# EAGLE board isolator (EAGLE 5.06), part 1 of 2
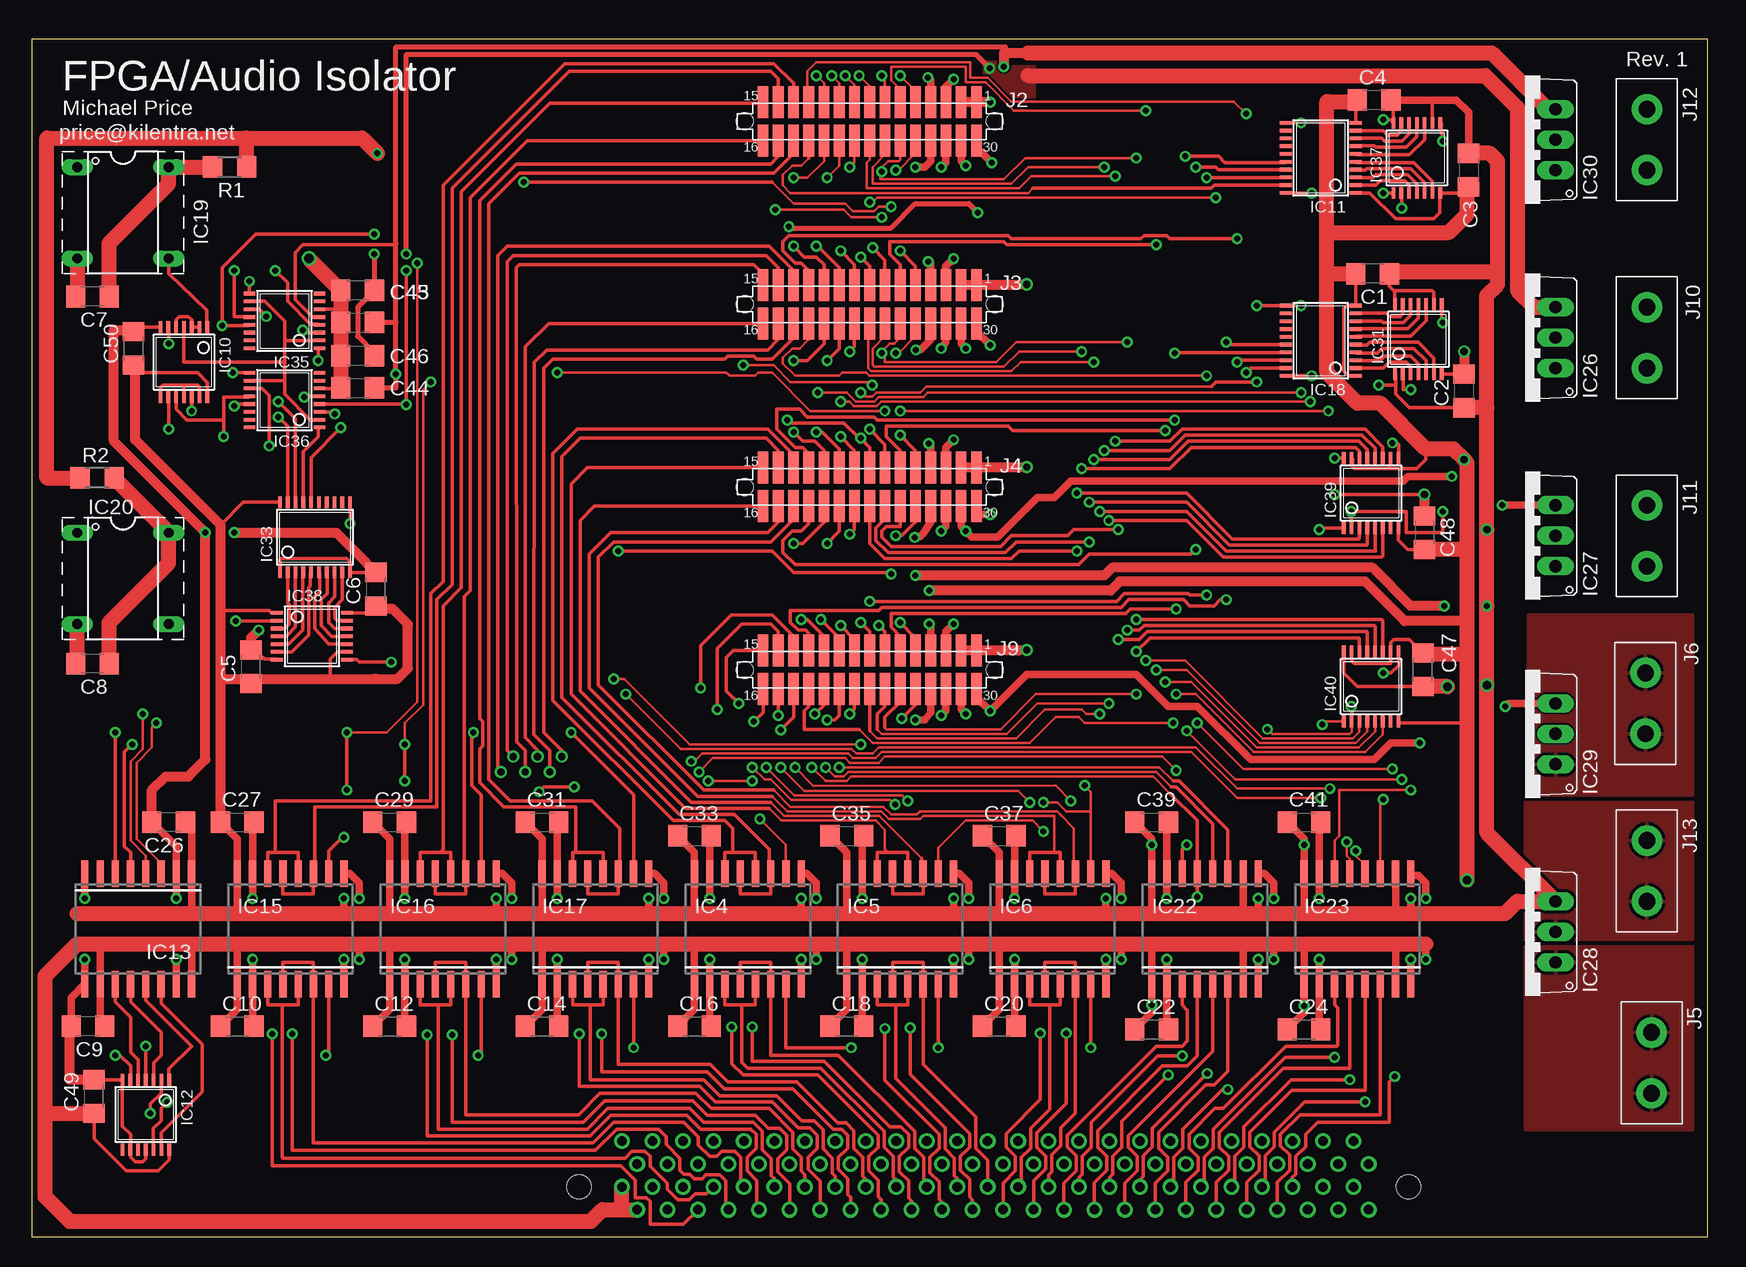
[diagram p9: board, top side]
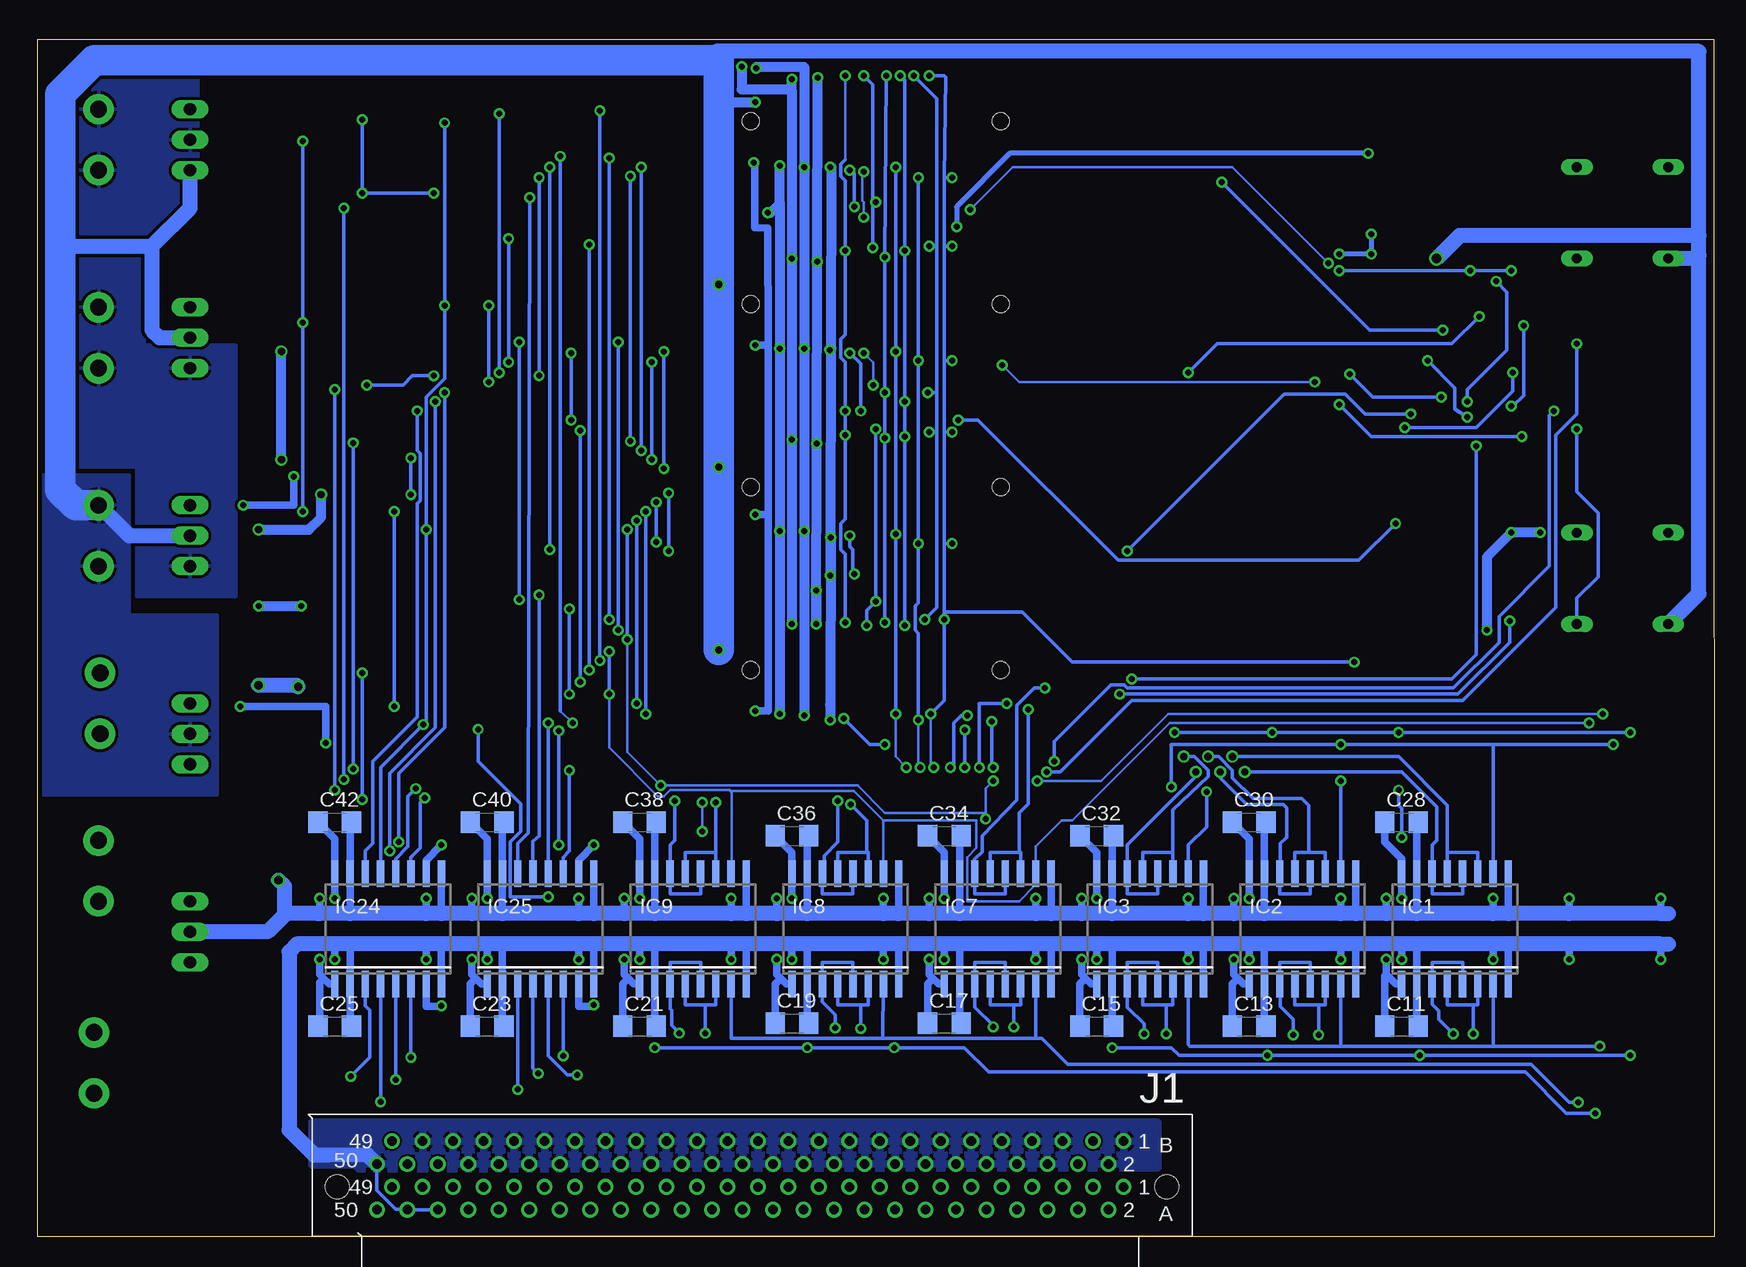
[diagram p10: board, bottom side, seen from below]

Size 139.7 x 99.83 mm. Coordinates in mm from the lower left corner, seen from the top.
Outline: 139.7,0 139.7,99.83 0.03,99.83 0,0 139.7,0
Copper layers (1*16): Top 0.035mm / dielectric 1.5mm / Bottom 0.035mm
Design rules "6mils": minimum track width 8mil, minimum drill 15mil, track to track 6mil, track to pad 6mil, pad to pad 6mil, via to via 6mil, smd to smd 6mil, copper to edge 15mil, drill to drill 8mil, minimum pad ring 10mil, minimum via ring 8mil, stop-mask expansion 4mil, vias tented up to drill 0mil, thermal gap 10mil

## Footprints (pad centres in the part's own frame; a part is rotated, then mirrored left to right if it is on the bottom)
C1206 = smd 1.6 x 1.8: 1 -1.4,0; 2 1.4,0
SO-16W = smd 0.6 x 2.2: 1 -4.445,-4.6; 2 -3.175,-4.6; 3 -1.905,-4.6; 4 -0.635,-4.6; 5 0.635,-4.6; 6 1.905,-4.6; 7 3.175,-4.6; 8 4.445,-4.6; 9 4.445,4.6; 10 3.175,4.6; 11 1.905,4.6; 12 0.635,4.6; 13 -0.635,4.6; 14 -1.905,4.6; 15 -3.175,4.6; 16 -4.445,4.6
TSSOP14 = smd 0.305 x 0.991: 1 -1.95,-2.918; 2 -1.3,-2.918; 3 -0.65,-2.918; 4 0,-2.918; 5 0.65,-2.918; 6 1.3,-2.918; 7 1.95,-2.918; 8 1.95,2.918; 9 1.3,2.918; 10 0.65,2.918; 11 0,2.918; 12 -0.65,2.918; 13 -1.3,2.918; 14 -1.95,2.918
TSSOP20 = smd 0.305 x 0.991: 1 -2.925,-2.918; 2 -2.275,-2.918; 3 -1.625,-2.918; 4 -0.975,-2.918; 5 -0.325,-2.918; 6 0.325,-2.918; 7 0.975,-2.918; 8 1.625,-2.918; 9 2.275,-2.918; 10 2.925,-2.918; 11 2.925,2.918; 12 2.275,2.918; 13 1.625,2.918; 14 0.975,2.918; 15 0.325,2.918; 16 -0.325,2.918; 17 -0.975,2.918; 18 -1.625,2.918; 19 -2.275,2.918; 20 -2.925,2.918
DIP4-XO = drill 0.813 long: 1 -3.81,-3.81; 4 3.81,-3.81; 5 3.81,3.81; 8 -3.81,3.81
TO220-PREG = drill 1.016 long: 1 -2.54,0; 2 0,0; 3 2.54,0
TO220-NREG = drill 1.016 long: 1 -2.54,0; 2 0,0; 3 2.54,0
TSSOP16 = smd 0.305 x 0.991: 1 -2.275,-2.918; 2 -1.625,-2.918; 3 -0.975,-2.918; 4 -0.325,-2.918; 5 0.325,-2.918; 6 0.975,-2.918; 7 1.625,-2.918; 8 2.275,-2.918; 9 2.275,2.918; 10 1.625,2.918; 11 0.975,2.918; 12 0.325,2.918; 13 -0.325,2.918; 14 -0.975,2.918; 15 -1.625,2.918; 16 -2.275,2.918
HIROSE-FX2-100 = drill 0.8 round: A1 -44.45,6.985; A2 -43.18,8.89; A3 -41.91,6.985; A4 -40.64,8.89; A5 -39.37,6.985; A6 -38.1,8.89; A7 -36.83,6.985; A8 -35.56,8.89; A9 -34.29,6.985; A10 -33.02,8.89; A11 -31.75,6.985; A12 -30.48,8.89; A13 -29.21,6.985; A14 -27.94,8.89; A15 -26.67,6.985; A16 -25.4,8.89; A17 -24.13,6.985; A18 -22.86,8.89; A19 -21.59,6.985; A20 -20.32,8.89; A21 -19.05,6.985; A22 -17.78,8.89; A23 -16.51,6.985; A24 -15.24,8.89; A25 -13.97,6.985; A26 -12.7,8.89; A27 -11.43,6.985; A28 -10.16,8.89; A29 -8.89,6.985; A30 -7.62,8.89; A31 -6.35,6.985; A32 -5.08,8.89; A33 -3.81,6.985; A34 -2.54,8.89; A35 -1.27,6.985; A36 0,8.89; A37 1.27,6.985; A38 2.54,8.89; A39 3.81,6.985; A40 5.08,8.89; A41 6.35,6.985; A42 7.62,8.89; A43 8.89,6.985; A44 10.16,8.89; A45 11.43,6.985; A46 12.7,8.89; A47 13.97,6.985; A48 15.24,8.89; A49 16.51,6.985; A50 17.78,8.89; B1 -44.45,3.175; B2 -43.18,5.08; B3 -41.91,3.175; B4 -40.64,5.08; B5 -39.37,3.175; B6 -38.1,5.08; B7 -36.83,3.175; B8 -35.56,5.08; B9 -34.29,3.175; B10 -33.02,5.08; B11 -31.75,3.175; B12 -30.48,5.08; B13 -29.21,3.175; B14 -27.94,5.08; B15 -26.67,3.175; B16 -25.4,5.08; B17 -24.13,3.175; B18 -22.86,5.08; B19 -21.59,3.175; B20 -20.32,5.08; B21 -19.05,3.175; B22 -17.78,5.08; B23 -16.51,3.175; B24 -15.24,5.08; B25 -13.97,3.175; B26 -12.7,5.08; B27 -11.43,3.175; B28 -10.16,5.08; B29 -8.89,3.175; B30 -7.62,5.08; B31 -6.35,3.175; B32 -5.08,5.08; B33 -3.81,3.175; B34 -2.54,5.08; B35 -1.27,3.175; B36 0,5.08; B37 1.27,3.175; B38 2.54,5.08; B39 3.81,3.175; B40 5.08,5.08; B41 6.35,3.175; B42 7.62,5.08; B43 8.89,3.175; B44 10.16,5.08; B45 11.43,3.175; B46 12.7,5.08; B47 13.97,3.175; B48 15.24,5.08; B49 16.51,3.175; B50 17.78,5.08 | hole 2: 21.09,6.984; -48.032,6.985
FCI-SMD-30 = smd 0.889 x 2.667: 1 -8.89,-1.6; 2 -7.62,-1.6; 3 -6.35,-1.6; 4 -5.08,-1.6; 5 -3.81,-1.6; 6 -2.54,-1.6; 7 -1.27,-1.6; 8 0,-1.6; 9 1.27,-1.6; 10 2.54,-1.6; 11 3.81,-1.6; 12 5.08,-1.6; 13 6.35,-1.6; 14 7.62,-1.6; 15 8.89,-1.6; 16 8.89,1.6; 17 7.62,1.6; 18 6.35,1.6; 19 5.08,1.6; 20 3.81,1.6; 21 2.54,1.6; 22 1.27,1.6; 23 0,1.6; 24 -1.27,1.6; 25 -2.54,1.6; 26 -3.81,1.6; 27 -5.08,1.6; 28 -6.35,1.6; 29 -7.62,1.6; 30 -8.89,1.6 | hole 1.4: -10.414,0; 10.414,0
FASTON-0.250 = drill 1.4 pad 2.54 round: A@1 -2.54,0; A@2 2.54,0
R1206 = smd 1.6 x 1.803: 1 -1.422,0; 2 1.422,0

## Placement (x,y rotation side)
C1  0.1u  [C1206]  111.76,80.26 180 top
C2  0.1u  [C1206]  119.38,70.48 90 top
C3  0.1u  [C1206]  119.76,88.9 270 top
C4  0.1u  [C1206]  111.89,94.74 180 top
C5  0.1u  [C1206]  18.29,47.5 90 top
C6  0.1u  [C1206]  28.7,53.98 90 top
C7  0.1u  [C1206]  5.08,78.36 180 top
C8  0.1u  [C1206]  5.08,47.75 180 top
C9  0.1u  [C1206]  4.7,17.53 180 top
C10  0.1u  [C1206]  17.15,17.53 0 top
C11  0.1u  [C1206]  26.04,17.53 0 bottom
C12  0.1u  [C1206]  29.85,17.53 0 top
C13  0.1u  [C1206]  38.74,17.53 0 bottom
C14  0.1u  [C1206]  42.55,17.53 0 top
C15  0.1u  [C1206]  51.44,17.53 0 bottom
C16  0.1u  [C1206]  55.25,17.53 0 top
C17  0.1u  [C1206]  64.14,17.78 0 bottom
C18  0.1u  [C1206]  67.95,17.53 0 top
C19  0.1u  [C1206]  76.84,17.78 0 bottom
C20  0.1u  [C1206]  80.65,17.53 0 top
C21  0.1u  [C1206]  89.54,17.53 0 bottom
C22  0.1u  [C1206]  93.35,17.27 0 top
C23  0.1u  [C1206]  102.24,17.53 0 bottom
C24  0.1u  [C1206]  106.05,17.27 0 top
C25  0.1u  [C1206]  114.94,17.53 0 bottom
C26  0.1u  [C1206]  11.43,34.54 180 top
C27  0.1u  [C1206]  17.15,34.54 0 top
C28  0.1u  [C1206]  26.04,34.54 0 bottom
C29  0.1u  [C1206]  29.85,34.54 0 top
C30  0.1u  [C1206]  38.74,34.54 0 bottom
C31  0.1u  [C1206]  42.55,34.54 0 top
C32  0.1u  [C1206]  51.44,33.4 0 bottom
C33  0.1u  [C1206]  55.25,33.4 0 top
C34  0.1u  [C1206]  64.14,33.4 0 bottom
C35  0.1u  [C1206]  67.95,33.4 0 top
C36  0.1u  [C1206]  76.84,33.4 0 bottom
C37  0.1u  [C1206]  80.65,33.4 0 top
C38  0.1u  [C1206]  89.54,34.54 0 bottom
C39  0.1u  [C1206]  93.35,34.54 0 top
C40  0.1u  [C1206]  102.24,34.54 0 bottom
C41  0.1u  [C1206]  106.05,34.54 0 top
C42  0.1u  [C1206]  114.94,34.54 0 bottom
C43  0.1u  [C1206]  27.18,78.87 180 top
C44  0.1u  [C1206]  27.18,73.41 180 top
C45  0.1u  [C1206]  27.18,76.2 0 top
C46  0.1u  [C1206]  27.18,70.74 0 top
C47  0.1u  [C1206]  115.95,47.24 90 top
C48  0.1u  [C1206]  116.08,58.67 270 top
C49  0.1u  [C1206]  5.21,11.68 90 top
C50  0.1u  [C1206]  8.51,74.04 90 top
IC1  ADUM3402  [SO-16W]  21.59,25.65 0 bottom
IC2  ADUM3402  [SO-16W]  34.29,25.65 0 bottom
IC3  ADUM3402  [SO-16W]  46.99,25.65 0 bottom
IC4  ADUM3402  [SO-16W]  59.69,25.65 0 top
IC5  ADUM3402  [SO-16W]  72.39,25.65 0 top
IC6  ADUM3402  [SO-16W]  85.09,25.65 0 top
IC7  ADUM3402  [SO-16W]  59.69,25.65 0 bottom
IC8  ADUM3402  [SO-16W]  72.39,25.65 0 bottom
IC9  ADUM3402  [SO-16W]  85.09,25.65 0 bottom
IC10  7404MT  [TSSOP14]  12.7,72.9 180 top
IC11  74LVTH574  [TSSOP20]  107.44,89.92 90 top
IC12  7404MT  [TSSOP14]  9.53,10.16 180 top
IC13  ADUM3400  [SO-16W]  8.89,25.65 180 top
IC15  ADUM3402  [SO-16W]  21.59,25.65 0 top
IC16  ADUM3402  [SO-16W]  34.29,25.65 0 top
IC17  ADUM3402  [SO-16W]  46.99,25.65 0 top
IC18  74LVTH574  [TSSOP20]  107.44,74.68 90 top
IC19  TENT-XO  [DIP4-XO]  7.62,85.34 270 top
IC20  TENT-XO  [DIP4-XO]  7.62,54.86 270 top
IC22  ADUM3401  [SO-16W]  97.79,25.65 0 top
IC23  ADUM3402  [SO-16W]  110.49,25.65 0 top
IC24  ADUM3401  [SO-16W]  110.49,25.65 0 bottom
IC25  ADUM3402  [SO-16W]  97.79,25.65 0 bottom
IC26  15V  [TO220-PREG]  127,74.93 90 top
IC27  5V  [TO220-PREG]  127,58.42 90 top
IC28  3.3V  [TO220-PREG]  127,25.4 90 top
IC29  3.3V  [TO220-PREG]  127,41.91 90 top
IC30  -15v  [TO220-NREG]  127,91.44 90 top
IC31  74164FT  [TSSOP14]  115.57,74.8 0 top
IC33  74LVTH574  [TSSOP20]  23.62,58.29 0 top
IC35  ADG1436YRUZ  [TSSOP16]  21.08,76.33 90 top
IC36  ADG1436YRUZ  [TSSOP16]  21.08,69.72 90 top
IC37  74164FT  [TSSOP14]  115.44,89.92 0 top
IC38  74164FT  [TSSOP14]  23.37,50.04 270 top
IC39  74165FT  [TSSOP16]  111.63,61.98 0 top
IC40  74165FT  [TSSOP16]  111.63,45.85 0 top
J1  HIROSE-FX2-100S-1.27DS  [HIROSE-FX2-100]  93.65,11.13 180 bottom
J2  SMD-30  [FCI-SMD-30]  69.85,92.96 180 top
J3  SMD-30  [FCI-SMD-30]  69.85,77.72 180 top
J4  SMD-30  [FCI-SMD-30]  69.85,62.48 180 top
J5  FASTON-0.250  [FASTON-0.250]  135,14.48 90 top
J6  FASTON-0.250  [FASTON-0.250]  134.49,44.45 270 top
J9  SMD-30  [FCI-SMD-30]  69.85,47.24 180 top
J10  FASTON-0.250  [FASTON-0.250]  134.62,74.93 90 top
J11  FASTON-0.250  [FASTON-0.250]  134.62,58.42 90 top
J12  FASTON-0.250  [FASTON-0.250]  134.62,91.44 90 top
J13  FASTON-0.250  [FASTON-0.250]  134.62,30.48 90 top
R1  Bead  [R1206]  16.51,89.15 180 top
R2  Bead  [R1206]  5.46,63.25 0 top

## Tracks (layer width: path | path; a pad name or v marks a point on that pad's centre or on a via)
!AMCS  (via drill 0.5)
  Top 0.229: v96.27,42.16 100.33,38.1 v114.17,38.1
  Top 0.305: IC22.14 95.89,32.26 v96.27,32.64 | v114.17,85.72 114.17,86.97 IC37.2
  Bottom 0.305: v96.27,32.64 v96.27,42.16 | v114.17,38.1 v114.17,85.72
!AMCS0
  Top 0.229: 64.77,89.92 64.14,89.28 63.37,89.28 62.61,88.52 62.61,87.63 63.25,87 83.06,87 83.45,87.39
  Top 0.305: 64.77,89.92 J2.19 | 83.45,87.39 98.3,87.38 98.55,87.64 IC11.19
!AMCS1  (via drill 0.5)
  Top 0.229: 64.77,74.8 64.01,74.04 63.37,74.04 62.61,73.28 62.61,72.77 63.63,71.75 67.31,71.75 67.56,72.01 69.55,72.01 69.8,71.75 v97.92,71.75
  Top 0.305: 64.77,74.8 J3.19 | IC11.18 98.2,88.29 v97.92,88.27
  Bottom 0.305: v97.92,71.75 v97.92,88.27
!AMCS2  (via drill 0.5)
  Top 0.305: J4.19 64.77,59.44 64.14,58.8 63.37,58.8 62.61,58.04 62.61,57.02 63.63,56.01 79.63,56.01 | 79.63,56.01 80.14,56.01 | IC11.17 98.89,88.94 98.68,89.15 v97.03,89.15 | v97.03,57.28 96.65,56.9 88.14,56.9 87.25,56.01 79.63,56.01
  Bottom 0.305: v97.03,57.28 v97.03,89.15
!AMCS3  (via drill 0.5)
  Top 0.229: v95.12,42.8 87.76,42.8 87.25,43.31 85.34,43.31 83.19,41.15 70.1,41.15 68.96,42.29
  Top 0.305: J9.19 64.77,44.2 64.39,43.81 64.39,42.29 68.96,42.29 | IC11.16 104.47,89.53 99.44,89.53 98.93,90.04 v96.14,90.04
  Bottom 0.229: v95.12,42.8 96.14,43.81
  Bottom 0.305: 96.14,43.81 v96.14,90.04
!DMCS  (via drill 0.5)
  Top 0.229: IC23.14 108.59,33.02 108.97,33.4 108.97,37.21 v114.94,37.21
  Top 0.305: v114.94,70.61 114.3,70.61 114.3,71.86 IC31.2
  Bottom 0.305: v114.94,37.21 v114.94,70.61
!DMCS0  (via drill 0.5)
  Top 0.229: J2.12 64.77,95.76 64.64,95.89 64.64,97.16 65.41,97.92 78.23,97.92 78.23,96.6 79.68,96.6 81.66,94.61 100.2,94.61 v101.22,93.6
  Top 0.305: IC18.19 101.61,72.4 v101.22,72.01
  Bottom 0.305: v101.22,93.6 v101.22,72.01
!DMCS1  (via drill 0.5)
  Top 0.305: J3.12 64.77,80.52 64.14,81.15 63.63,81.15 62.61,82.17 62.61,82.93 63.12,83.44 79.76,83.44 | 79.76,83.44 80.14,83.44 | IC18.18 100.61,73.05 v100.46,72.9 | 79.76,83.44 81.41,83.44 81.66,83.19 92.46,83.19 92.71,83.44 94.62,83.44 94.87,83.19 v100.46,83.19
  Bottom 0.305: v100.46,83.19 v100.46,72.9
!DMCS2  (via drill 0.5)
  Top 0.305: 64.77,64.01 J4.12 64.77,65.28 64.26,65.79 63.63,65.79 62.1,67.31 62.1,68.96 64.01,68.96 64.64,68.33 70.23,68.33 70.49,68.07 v95.25,68.07 | IC18.17 95.55,73.7 v95.25,73.66
  Bottom 0.305: v95.25,68.07 v95.25,73.66
!DMCS3  (via drill 0.5)
  Top 0.305: J9.12 64.77,50.29 64.52,50.55 63.88,50.55 63.25,51.18 63.25,52.2 70.61,52.2 70.87,52.45 90.81,52.45 91.44,53.09 96.01,53.09 96.52,52.58 98.55,52.58 99.06,53.09 v99.57,53.09 | IC18.16 99.75,74.35 v99.57,74.55
  Bottom 0.305: v99.57,53.09 v99.57,74.55
!ISLOTDIR0  (via drill 0.5)
  Top 0.305: v50.17,15.75 IC17.7 | IC16.7 37.47,15.37 v37.21,15.11 | IC15.7 24.77,15.37 v24.51,15.11 | v6.99,15.11 7.37,15.11 8.26,14.22 8.26,13.11 IC12.6
  Bottom 0.305: v50.17,15.75 45.21,15.75 44.58,15.11 v37.21,15.11 v24.51,15.11 v6.99,15.11
!ISLOTDIR1  (via drill 0.5)
  Top 0.305: IC12.4 v9.53,15.88
  Bottom 0.305: v9.53,15.88 18.54,15.88 | 18.54,15.88 30.99,15.88 | 30.99,15.88 43.69,15.88 43.82,16 IC3.7 | IC2.7 31.12,16 30.99,15.88 | IC1.7 18.42,16 18.54,15.88
!ISLOTDIR2  (via drill 0.5)
  Top 0.305: v88.27,15.75 IC6.7 | v75.57,15.75 IC5.7 | IC4.7 62.87,15.75 v68.33,15.75 | v9.91,10.29 9.91,11.05 10.8,11.94 10.8,13.05 IC12.2
  Bottom 0.305: v9.91,10.29 12.32,10.29 15.75,13.72 60.45,13.72 62.48,15.75 v68.33,15.75 v75.57,15.75 v88.27,15.75
!ISLOTDIR3  (via drill 0.5)
  Top 0.305: v11.3,11.18 10.8,10.67 10.8,9.65 10.16,9.02 10.16,7.26 IC12.12
  Bottom 0.305: v11.3,11.18 12.07,11.18 15.24,14.35 53.85,14.35 56.01,16.51 56.52,16.51 | 56.52,16.51 69.28,16.51 | 69.28,16.51 81.92,16.51 IC9.7 | 69.28,16.51 IC8.7 | 56.52,16.51 IC7.7
+15V  (via drill 0.5)
  Top 0.305: IC36.13 17.07,69.4 v16.89,69.22 | IC35.13 18.11,75.95 v15.88,75.95 15.88,80.77 18.67,83.57 v28.58,83.57
  Top 0.406: v28.58,81.92 v28.58,81.91 C43.1 27.18,77.47 27.18,75.06 28.58,73.66 C44.1 | v31.24,81.92 31.24,98.55 78.69,98.55 v79.83,97.41
  Top 0.61: J2.28 76.2,89.53 v75.82,89.15 | J3.28 76.2,74.55 v75.82,74.04 | J4.28 76.2,59.18 v75.82,58.8 | J9.28 76.2,43.81 v75.82,43.43
  Top 1.27: IC26.3 125.22,77.47 123.83,78.87 123.83,94.11 121.16,96.77 83.06,96.77
  Bottom 0.305: v16.89,69.22 16.76,69.22 15.88,70.1 v15.88,75.95
  Bottom 0.406: v31.24,81.92 v28.58,81.92 v28.58,83.57
  Bottom 0.813: v75.82,43.43 v75.82,58.8 v75.82,74.04 v75.82,89.15 75.82,97.51 79.78,97.51 v79.83,97.41
  pour Top: 79.38,97.92 81.28,97.92 81.28,97.54 83.57,97.54 83.57,95 81.03,95 79.38,96.65
-15V  (via drill 0.5)
  Top 0.305: IC35.5 23.42,76.65 21.97,78.11 21.97,82.04 22.61,82.68 30.23,82.68 30.35,82.8 | IC36.5 22.8,70.05 v22.73,69.98
  Top 0.406: 30.35,76.2 C45.2 | 30.35,76.2 30.35,82.8 30.35,99.19 81.15,99.19 81.15,98.81 81.03,98.68 | C46.2 30.35,70.74 30.35,71.63 v30.35,71.88 30.35,76.2
  Top 0.61: J2.3 76.2,95.86 v76.84,96.5 | J3.3 76.2,80.9 v76.84,81.53 | J4.3 76.2,65.79 v76.84,66.42 | J9.3 76.2,50.42 v76.84,51.05
  Top 0.813: 83.06,98.68 81.03,98.68 v81.03,97.54
  Top 1.27: IC30.3 126.37,93.98 121.67,98.68 83.06,98.68
  Bottom 0.305: v22.73,69.98 28.45,69.98 v30.35,71.88
  Bottom 0.813: v76.84,51.05 v76.84,66.42 v76.84,81.53 76.84,95.5 | 76.84,95.5 v76.84,96.5 | v81.03,97.54 81.03,95.63 76.96,95.63 76.84,95.5
A3.3V  (via drill 0.5)
  Top 0.61: J9.30 78.74,44.96 v79.88,43.81 82.93,46.86 92.08,46.86 94.74,44.2 97.16,44.2 101.6,39.75 111.89,39.75 113.28,41.15 v115.7,41.15 | J4.30 78.74,60.2 v79.88,60.2 | J3.30 78.74,75.44 v79.88,74.3 | J2.30 78.74,90.81 v80.01,89.53 | IC29.3 123.06,44.45 v122.81,44.2
  Bottom 0.61: 78.82,44.07 78.82,43.81 | 78.82,44.07 78.82,59.56 | 78.82,59.56 78.82,74.42 | 78.82,74.42 78.87,84.07 79.96,84.12 79.96,89.53 v80.01,89.53 | v79.88,43.81 79.12,43.81 78.82,44.07 | v79.88,60.2 78.87,60.2 78.82,59.56 | v79.88,74.3 78.99,74.3 78.82,74.42 | v122.81,44.2 115.7,44.2 v115.7,41.15
A5V  (via drill 0.5)
  Top 0.406: v78.87,85.34 78.11,86.11 73.66,86.11 71.63,84.07 63.25,84.07 v63.12,84.2
  Top 0.61: J2.29 77.47,89.66 v77.85,89.28 | J3.29 77.47,74.42 v77.85,74.04 | J4.29 77.47,59.18 v77.85,58.8 78.36,58.29 80.52,58.29 83.82,61.59 85.22,61.59 86.61,62.99 114.3,62.99 114.68,63.37 v118.36,63.37 | J9.29 77.47,43.94 v77.85,43.56 | v122.56,60.96 IC27.3
  Top 1.27: v28.83,90.3 27.56,91.57 17.91,91.57 | 17.91,91.57 1.27,91.57 1.27,63.25 3.81,63.25 3.84,63.22 R2.1 | R1.1 17.91,89.18 17.91,91.57
  Bottom 0.406: 63.12,84.07 v63.12,84.2 63.12,85.85 58.67,90.3 v28.83,90.3
  Bottom 0.61: v122.56,60.96 118.36,60.96 v118.36,63.37
  Bottom 0.813: v77.85,43.56 v77.85,58.8 v77.85,74.04 77.85,86.11 | 77.85,86.11 v77.85,89.28 | 77.85,86.11 78.61,85.34 v78.87,85.34
ACON0  (via drill 0.5)
  Top 0.229: J2.7 71.12,96.77 v70.87,96.77 | v98.68,86.61 70.49,86.61 70.1,86.23 v69.85,86.23
  Top 0.305: v70.1,82.42 71.12,81.41 J3.7
  Bottom 0.229: v69.85,86.23 70.1,86.23
  Bottom 0.305: v70.1,82.42 70.1,86.23 70.1,96.01 v70.87,96.77 | IC25.14 99.7,32.77 98.81,33.66 v98.68,86.61
ACON1  (via drill 0.5)
  Top 0.305: J4.7 71.12,66.04 v69.85,67.31 | v70.61,50.93 71.12,50.42 J9.7 | v69.85,52.96 90.42,52.96 91.06,53.59 96.39,53.59 96.52,53.47 v97.92,53.47
  Bottom 0.305: v70.61,50.93 70.61,52.2 v69.85,52.96 v69.85,67.31 | v97.92,53.47 97.92,33.4 98.43,32.92 IC25.13
AGND  (via drill 0.5, 0.6, 0.8)
  Top 0.305: IC35.6 25.44,77.3 25.78,76.96 | IC36.6 25.74,70.7 C46.1
  Top 0.813: J2.2 J2.1 v79.88,94.56 | J3.2 J3.1 82.09,79.32 v82.93,79.38 | J4.2 J4.1 82.25,64.08 v82.93,64.14 | J9.2 J9.1 82.25,48.84 v82.93,48.9
  Top 1.27: IC19.4 3.81,78.49 C7.2 | IC20.4 3.81,47.88 C8.2 | C46.1 C44.2 C45.1 25.78,76.96 C43.2 v23.11,81.53
  Bottom 0.305: 82.93,98.04 82.93,98.17 83.19,98.81
  Bottom 0.813: 82.93,94.56 v79.88,94.56
  Bottom 1.27: 83.19,98.81 1.27,98.81 1.27,83.44 | 1.27,81.79 1.27,53.59 IC20.4 | 1.27,81.79 1.27,83.44 | IC19.4 1.52,81.53 1.27,81.79 | v23.11,81.53 21.21,83.44 1.27,83.44 | IC30.1 127,85.72 130.18,82.55 | 130.18,82.55 137.16,82.55 137.8,84.45 | IC26.2 129.54,74.93 130.18,75.56 130.18,82.55 | IC27.2 132.08,58.42 J11.A@2
  Bottom 2.54: v82.93,48.9 v82.93,64.14 v82.93,79.38 82.93,94.56 82.93,98.04 135,98.04 137.8,95.25 137.8,84.45 137.8,62.23 136.53,60.96 J11.A@2
  pour Bottom (isolate 0.254): 132.08,63.5 139.7,63.5 139.7,36.83 132.08,36.83 124.71,36.83 124.71,51.82 132.08,51.82
AMDI  (via drill 0.5)
  Top 0.229: J2.21 67.31,89.28 v66.29,88.27 | 95,37.47 93.73,38.73 68.07,38.73 67.69,38.35 66.93,38.35 v66.17,39.12
  Top 0.305: J3.21 67.31,74.04 v66.29,73.03 | J4.21 67.31,58.8 v66.29,57.78 | J9.21 67.31,43.43 66.93,43.05 v66.29,43.05 | IC22.12 98.43,34.42 95.38,37.47 95,37.47
  Bottom 0.229: v66.17,39.12 66.29,39.24 v66.29,43.05
  Bottom 0.305: v66.29,88.27 v66.29,73.03 v66.29,57.78 66.29,52.83 66.55,52.58 66.55,50.55 66.29,50.29 v66.29,43.05
AMDO  (via drill 0.5)
  Top 0.229: v68.2,89.15 68.58,89.53 J2.22 | 95.12,37.97 93.98,39.12 v67.31,39.12
  Top 0.305: v68.2,73.79 68.58,74.17 J3.22 | v68.2,58.55 68.58,58.93 J4.22 | J9.22 68.58,43.94 v68.2,43.56 | IC22.11 99.7,33.91 95.63,37.97 95.12,37.97
  Bottom 0.229: v67.31,39.12 68.2,40.01 v68.2,43.56
  Bottom 0.305: v68.2,43.56 v68.2,58.55 v68.2,73.79 v68.2,89.15
AOVF  (via drill 0.5)
  Top 0.229: v97.16,42.8 100.97,38.99 v113.41,38.99
  Top 0.305: v113.41,66.17 113.79,66.17 113.92,66.04 113.92,64.91 IC39.9
  Bottom 0.305: IC25.12 v97.16,42.8 | v113.41,38.99 v113.41,66.17
AOVFL0  (via drill 0.5)
  Top 0.229: J2.23 69.85,89.79 69.6,89.53 69.6,87.38 82.3,87.38 83.31,88.39 v90.3,88.39
  Top 0.305: v90.3,66.29 94.87,66.29 95.89,67.31 111.13,67.31 112.61,65.83 IC39.11
  Bottom 0.305: v90.3,66.29 v90.3,88.39
AOVFL1  (via drill 0.5)
  Top 0.229: 69.72,74.93 69.72,72.39 69.98,72.14 81.66,72.14 82.42,72.9 v88.52,72.9
  Top 0.305: 69.72,74.93 69.85,74.93 J3.23 | v88.52,64.77 94.87,64.77 96.39,66.29 110.62,66.29 111.31,65.6 IC39.13
  Bottom 0.305: v88.52,72.9 v88.52,64.77
AOVFL2  (via drill 0.5)
  Top 0.305: J4.23 69.85,57.78 71.12,56.52 81.66,56.52 82.3,57.15 v87.12,57.15 | IC39.3 110.66,58.21 110.62,58.17 100.08,58.17 96.27,61.98 v87.12,61.98
  Bottom 0.305: v87.12,57.15 v87.12,61.98
AOVFL3  (via drill 0.5)
  Top 0.229: 69.85,42.16 70.49,41.53 82.04,41.53 84.46,43.94 87.5,43.94 87.88,43.56 v89.03,43.56
  Top 0.305: 69.85,42.16 J9.23 | IC39.5 111.96,57.21 112.01,57.15 99.57,57.15 96.27,60.45 v89.03,60.45
  Bottom 0.305: v89.03,43.56 v89.03,60.45
AOVFR0  (via drill 0.5)
  Top 0.229: 71.12,90.17 70.1,89.15 70.1,87.76 81.66,87.76 83.06,89.15 v89.41,89.15
  Top 0.305: 71.12,90.17 J2.24 | v89.41,65.53 94.87,65.53 96.14,66.8 110.87,66.8 111.96,65.72 IC39.12
  Bottom 0.305: v89.41,65.53 v89.41,89.15
AOVFR1  (via drill 0.5)
  Top 0.229: 71.12,75.06 70.1,74.04 70.1,72.64 70.23,72.52 81.03,72.52 82.3,73.79 v87.5,73.79
  Top 0.305: 71.12,75.06 J3.24 | v87.5,64.01 94.87,64.01 96.65,65.79 110.36,65.79 110.66,65.49 IC39.14
  Bottom 0.305: v87.5,73.79 v87.5,64.01
AOVFR2  (via drill 0.5)
  Top 0.305: J4.24 71.12,59.82 70.36,59.05 70.36,58.04 71.37,57.02 81.15,57.02 82.04,57.91 v88.14,57.91 | IC39.4 111.31,57.71 111.25,57.66 99.82,57.66 96.27,61.21 v88.14,61.21
  Bottom 0.305: v88.14,57.91 v88.14,61.21
AOVFR3  (via drill 0.5)
  Top 0.229: 70.49,42.29 70.87,41.91 81.28,41.91 83.82,44.45 v89.79,44.45
  Top 0.305: J9.24 71.12,44.2 70.49,43.56 70.49,42.29 | IC39.6 112.61,56.73 112.52,56.64 99.31,56.64 96.27,59.69 v89.79,59.69
  Bottom 0.305: v89.79,44.45 v89.79,59.69
CHAN0  (via drill 0.5)
  Top 0.229: J2.6 72.39,95.63 71.63,96.39 71.63,97.54 77.85,97.54 77.85,96.22 79.5,96.22 81.86,93.85 v92.84,93.85 | IC40.3 110.66,42.08 110.11,41.53 102.62,41.53 96.14,48.01 v92.84,48.01
  Bottom 0.305: v92.84,48.01 v92.84,93.85
CHAN1  (via drill 0.5)
  Top 0.229: IC40.4 111.31,42.09 110.36,41.15 102.36,41.15 96.27,47.24 v93.73,47.24
  Top 0.305: J3.6 72.39,81.03 71.5,81.92 71.5,82.93 81.03,82.93 81.28,82.68 v93.73,82.68
  Bottom 0.305: v93.73,47.24 v93.73,82.68
CHAN2  (via drill 0.5)
  Top 0.229: IC40.5 111.96,42.11 110.62,40.77 102.11,40.77 96.65,46.23 v94.49,46.23
  Top 0.305: J4.6 72.39,65.53 71.25,66.67 71.25,67.56 81.41,67.56 81.79,67.18 v94.49,67.18
  Bottom 0.305: v94.49,67.18 v94.49,46.23
CHAN3  (via drill 0.5)
  Top 0.229: IC40.6 112.61,41.87 111.13,40.39 101.85,40.39 97.03,45.21 v95.38,45.21
  Top 0.305: J9.6 72.39,50.04 71.63,50.8 71.63,51.94 91.19,51.94 91.57,52.32 v95.38,52.32
  Bottom 0.305: v95.38,52.32 v95.38,45.21
CLK0
  Top 0.305: IC19.5 11.43,80.26 14.61,77.22 14.61,75.86 IC10.1
CLK0A
  Top 0.305: IC10.4 12.7,72.9 21.08,72.9 | 21.08,72.9 21.08,71.37 | 21.08,71.37 21.08,70.23 23.24,68.07 23.97,68.07 IC36.2 | IC36.10 21.06,71.35 21.08,71.37 | 21.08,72.9 21.08,74.8 | 21.08,74.8 21.08,76.33 19.43,77.98 18.14,77.98 IC35.10 | IC35.2 21.18,74.7 21.08,74.8
CLK0B  (via drill 0.5)
  Top 0.229: v95.38,38.86 94.23,40.01 71.12,40.01 70.61,39.5 68.2,39.5 67.82,39.88 56.77,39.88 v55.63,38.73
  Top 0.305: v11.43,74.42 11.43,75.79 IC10.6
  Bottom 0.305: IC25.11 95.89,31.62 95.38,32.13 v95.38,38.86 | v55.63,38.73 54.48,38.73 48.51,44.7 20.96,44.7 13.21,52.45 13.21,66.8 11.43,68.58 v11.43,74.42
CLK1  (via drill 0.5)
  Top 0.305: IC10.9 11.43,69.95 v11.43,67.31
  Bottom 0.305: IC20.5 11.43,53.21 9.65,54.99 9.65,60.33 11.43,62.1 v11.43,67.31
CLK1A  (via drill 0.5)
  Top 0.305: v31.24,80.52 v31.24,69.34 31.19,69.4 IC36.4 | v16.89,80.52 16.89,76.71 18.11,76.71 IC35.12 | 16,68.07 v16,66.67 | IC36.12 18.09,69.98 16,69.98 16,68.07 | IC10.10 12.05,68.98 12.95,68.07 16,68.07 | IC35.4 23.95,76 23.88,76.07 23.24,76.07 21.34,77.98 21.34,79.5 v20.32,80.52
  Bottom 0.305: v16,66.67 28.58,66.67 v31.24,69.34 | v31.24,80.52 v20.32,80.52 v16.89,80.52
CLK1B  (via drill 0.5)
  Top 0.229: v107.44,36.58 100.46,36.58 96.65,40.39 70.87,40.39 70.36,39.88 68.45,39.88 68.07,40.26 55.88,40.26 55.25,39.62 v54.99,39.62
  Top 0.305: v13.34,68.83 13.34,69.97 IC10.12
  Bottom 0.305: IC24.11 108.59,31.62 107.82,32.38 107.82,36.2 v107.44,36.58 | v54.99,39.62 54.99,41.27 50.29,45.97 49.15,45.97 48.9,45.72 21.72,45.72 17.91,49.53 17.91,51.69 13.72,55.88 13.72,68.45 v13.34,68.83
CLKSEL  (via drill 0.5)
  Top 0.229: v108.2,37.34 100.46,37.34 97.03,40.77 70.61,40.77 70.1,40.26 68.71,40.26 68.33,40.64 54.1,40.64 v49.53,45.21
  Top 0.305: v17.02,51.31 20.42,51.31 IC38.2
  Bottom 0.305: IC24.12 109.86,31.5 108.84,32.51 108.84,36.7 v108.2,37.34 | v49.53,45.21 21.34,45.21 17.02,49.53 v17.02,51.31
CLKSEL0  (via drill 0.5)
  Top 0.305: IC33.19 21.35,67.55 v20.57,68.33 | v23.88,73.03 23.88,73.93 IC35.1
  Bottom 0.305: v20.57,68.33 21.59,68.96 21.59,70.74 v23.88,73.03
CLKSEL1  (via drill 0.5)
  Top 0.305: IC33.18 22,68.17 v20.57,69.6 | v18.16,79.63 IC35.9
  Bottom 0.305: v20.57,69.6 20.57,70.61 17.27,73.91 17.27,78.74 v18.16,79.63
CLKSEL2
  Top 0.305: IC33.17 22.65,65.45 23.88,66.67 23.88,67.32 IC36.1
CLKSEL3  (via drill 0.5)
  Top 0.305: IC33.16 23.3,64.95 v25.78,67.44 | v16.76,72.01 IC36.9
  Bottom 0.305: v25.78,67.44 19.81,67.44 16.76,70.48 v16.76,72.01
D3.3V  (via drill 0.5, 0.6, 0.7)
  Top 0.305: C4.1 113.49,94.54 IC37.14 113.24,93.09 v112.65,93.09 | IC37.9 116.74,94.71 116.71,94.74 | IC10.14 14.65,71.2 13.84,72.01 9.14,72.01 C50.1 | IC38.14 28.12,51.99 C6.1 | IC33.20 17.65,61.21 15.75,59.31 | IC38.1 20.02,51.99 19.81,52.2 15.75,52.2 | IC38.9 25.5,48.74 24.89,48.13 24.89,46.48 | C1.1 113.16,79.25 113.54,78.87 113.67,78.87 | 113.67,78.87 116.71,78.87 116.84,78.74 116.84,77.75 IC31.9 | IC31.14 113.62,78.82 113.67,78.87 | C2.1 114.81,69.09 113.67,70.23 113.67,70.99 | 113.67,70.99 113.67,71.84 IC31.1 | IC18.20 106.18,71.75 v106.68,71.75 | 113.67,70.99 v112.27,70.99 | IC39.16 108.84,64.89 v108.59,64.9 | v108.59,61.85 v116.08,61.85 C48.1 | IC11.20 v106.68,86.99 v106.68,87 | IC37.1 v112.65,87 | IC40.16 109.35,48.75 109.35,46.99 110.49,45.84 C47.1 | C27.1
  Top 0.61: 17.15,26.92 IC15.16 17.15,33.14 C27.1 | 29.85,26.92 IC16.16 29.85,33.14 C29.1 | 42.55,26.92 IC17.16 42.55,33.14 C31.1 | 55.25,26.92 IC4.16 55.25,32 C33.1 | 67.95,26.92 IC5.16 67.95,32 C35.1 | 80.65,26.92 IC6.16 80.65,32 C37.1 | C39.1 93.35,33.14 v93.35,32.64 IC22.16 93.35,26.92 | C41.1 106.05,33.14 v106.05,32.64 IC23.16 106.05,26.92 | C26.1 13.34,34.04 IC13.1 13.34,26.92 | 113.67,26.92 IC23.10 | 100.97,26.92 IC22.10 | 114.94,26.92 v114.94,28.19 | 102.24,26.92 v102.24,28.19 | 89.54,26.92 v89.54,28.19 | 76.84,26.92 v76.84,28.19 | 64.14,26.92 v64.14,28.19 | 51.44,26.92 v51.44,28.19 | 38.74,26.92 v38.74,28.19 | 26.04,26.92 v26.04,28.19 | v73.66,89.15 74.42,89.15 74.93,89.66 J2.27 | J3.27 74.93,74.76 74.12,73.92 v73.7,73.91 | J4.27 74.93,59.56 74.3,58.59 74.04,58.33 v73.62,58.29 | J9.27 74.93,43.69 74.42,43.05 v73.66,43.05 | C3.1 119.76,93.73 118.75,94.74 116.71,94.74 C4.1
  Top 0.813: C27.1 15.75,46.35 | 15.75,46.35 15.75,52.2 15.75,59.31 8.64,66.42 8.64,72.51 C50.1 | 28.83,52.32 30.1,52.32 31.37,51.05 31.37,47.37 30.48,46.48 28.7,46.48 | 28.83,52.32 28.7,52.32 | 28.7,46.48 28.58,46.48 | C6.1 28.7,52.45 28.83,52.32 | 18.42,46.48 15.88,46.48 15.75,46.35 | 18.42,46.48 24.89,46.48 28.7,46.48 | C5.1 18.29,46.35 18.42,46.48 | v116.08,61.85 116.08,60.2 | v73.66,55.12 89.41,55.12 90.04,55.75 111.76,55.75 114.94,52.58 v117.73,52.58
  Top 1.27: 3.81,26.92 13.34,26.92 17.15,26.92 26.04,26.92 29.85,26.92 38.74,26.92 42.55,26.92 51.44,26.92 55.25,26.92 64.14,26.92 67.95,26.92 76.84,26.92 80.65,26.92 89.54,26.92 93.35,26.92 100.97,26.92 102.24,26.92 106.05,26.92 113.67,26.92 114.94,26.92 122.81,26.92 123.83,27.94 IC28.3 121.29,33.66 v121.29,45.97 v121.29,52.58 v121.29,58.93 121.29,69.09 | 121.29,69.09 121.29,78.49 122.17,79.38 122.17,80.39 | 122.17,80.39 122.17,89.66 121.54,90.3 C3.1 | 122.17,80.39 113.16,80.39 C1.1 | 121.29,69.09 C2.1 | C47.1 v117.98,45.85
  Bottom 0.305: v73.7,73.91 73.7,74.17 73.57,74.3 | v106.68,71.75 108.46,71.75 109.22,70.99 v112.27,70.99 | v108.59,61.85 v108.59,64.9 | v112.65,93.09 v112.65,87 v106.68,87
  Bottom 0.61: C28.1 27.43,32.89 26.04,31.49 IC1.16 v26.04,28.19 | C30.1 38.74,33.14 IC2.16 v38.74,28.19 | C32.1 51.44,32 IC3.16 v51.44,28.19 | C34.1 64.14,32 IC7.16 v64.14,28.19 | C36.1 76.84,32 IC8.16 v76.84,28.19 | C38.1 89.54,33.14 IC9.16 v89.54,28.19 | C40.1 102.24,33.14 IC25.16 v102.24,28.19 | C42.1 114.94,33.14 IC24.16 v114.94,28.19 | IC25.10 94.62,31.37 v93.35,32.64 | IC24.10 107.32,31.37 v106.05,32.64 | 73.58,74.04 73.58,74.17 | v73.62,58.29 73.62,59.56 | v73.66,43.05 73.66,44.32
  Bottom 0.813: v73.66,43.05 73.66,44.32 v73.62,58.29 | v73.62,58.29 73.58,74.17 73.58,74.04 73.57,74.3 73.53,89.15 v73.66,89.15 | v116.08,61.85 116.08,59.94 117.09,58.93 v121.29,58.93 | v121.29,52.58 v117.73,52.58 | v73.66,55.12 73.62,55.16 v73.62,58.29
  Bottom 1.27: v117.98,45.85 118.11,45.97 v121.29,45.97
DGND  (via drill 0.5, 0.6, 0.7)
  Top 0.305: IC10.7 8.88,75.82 C50.2 8.51,75.56 | IC11.10 110.36,94.61 C4.2 | C3.2 119.26,87 IC37.7 117.35,86.95 117.35,85.34 116.84,84.84 113.67,84.84 111.51,86.99 IC11.1 | C6.2 IC33.10 | IC33.10 | IC33.1 20.7,56.38 20.83,56.52 26.29,56.52 26.54,56.26 IC33.10 | 20.7,58.67 | IC38.7 20.45,48.13 19.43,48.13 C5.2 | IC18.1 109.73,71.75 109.35,72.14 109.35,77.34 109.6,77.6 IC18.10 C1.2 | C1.2 | IC39.10 113.26,64.24 113.03,64.01 | 113.03,64.01 110.24,64.01 110.11,64.14 110.11,64.79 IC39.15 | IC31.7 117.48,71.84 | C2.2 IC31.7 | 113.03,64.01 115.44,64.01 116.21,64.77 116.21,65.66 | IC39.8 113.91,58.04 114.68,57.28 C48.2 | C47.2 114.81,49.78 113.54,49.78 113.26,49.5 IC40.10 113.28,48.74 113.28,47.75 110.24,47.75 110.01,47.98 IC40.15 | IC40.8 114.04,42.8 119.63,42.8 | IC31.7
  Top 0.61: v4.45,28.19 IC13.8 | C27.2 18.42,34.41 IC15.15 v18.42,28.19 | C29.2 31.12,34.41 IC16.15 v31.12,28.19 | C31.2 43.82,34.41 IC17.15 v43.82,28.19 | C33.2 56.52,33.27 IC4.15 v56.52,28.19 | C35.2 69.22,33.27 IC5.15 v69.22,28.19 | C37.2 81.92,33.27 IC6.15 v81.92,28.19 | C39.2 94.62,34.41 IC22.15 v94.62,28.19 | C41.2 107.32,34.41 IC23.15 v107.32,28.19 | C26.2 12.07,32.51 IC13.2 v12.07,28.19 | IC23.9 114.94,30.1 115.57,30.1 116.21,29.46 v116.21,28.19 | IC15.9 26.52,30.25 27.31,29.46 v27.31,28.19 | IC16.9 39.22,30.25 40.01,29.46 v40.01,28.19 | IC17.9 51.92,30.25 52.71,29.46 v52.71,28.19 | IC4.9 64.62,30.25 65.41,29.46 v65.41,28.19 | IC22.9 102.72,30.25 103.51,29.46 v103.51,28.19 | IC6.9 90.02,30.25 90.81,29.46 v90.81,28.19 | IC5.9 77.32,30.25 78.11,29.46 v78.11,28.19 | J2.4 74.93,96.39 v74.7,96.62 | J9.4 74.93,50.93 v74.8,51.05 | J3.4 74.93,81.07 v74.72,81.28 | J4.4 74.93,65.95 v74.76,66.12
  Top 0.813: 8.51,75.56 6.86,75.56 6.86,66.29 v14.48,58.67 14.48,39.75 13.08,38.35 11.18,38.35 10.03,37.21 C26.2 | v16.89,58.67 20.7,58.67 25.4,58.67 26.92,57.15 27.05,57.03 C6.2 | C5.2 18.29,49.91 v18.92,50.55 | v119.38,73.79 C2.2 | 119.63,51.31 114.43,51.31 111.13,54.61 90.68,54.61 89.92,53.85 v74.8,53.85
  Top 1.27: 107.95,80.39 107.95,83.69 | 107.95,83.69 107.95,94.61 | 107.95,94.61 110.36,94.61 | 107.95,94.61 | C1.2 108.08,80.26 107.95,80.39 | 107.95,83.69 118.11,83.69 119.63,85.22 119.63,87.5 C3.2 | v119.63,29.72 119.63,42.8 119.63,48.51 | 119.63,48.51 119.63,51.31 119.63,57.28 | 119.63,57.28 119.63,64.52 v119.38,64.77 118.49,65.66 116.21,65.66 112.4,69.47 110.49,69.47 107.95,72.01 107.95,80.39 | C48.2 116.2,57.28 119.63,57.28 | C47.2 116.08,48.51 119.63,48.51
  Bottom 0.61: 4.45,26.92 v4.45,28.19 | C28.2 24.77,34.41 IC1.15 24.77,26.92 | C30.2 37.47,34.41 IC2.15 37.47,26.92 | C32.2 50.17,33.27 IC3.15 50.17,26.92 | C34.2 62.87,33.27 IC7.15 62.87,26.92 | C36.2 75.57,33.27 IC8.15 75.57,26.92 | C38.2 88.27,34.41 IC9.15 88.27,26.92 | C42.2 113.67,34.41 IC24.15 113.67,26.92 | C40.2 100.97,34.41 IC25.15 100.97,26.92 | 27.31,26.92 v27.31,28.19 | 93.35,26.92 IC25.9 | 106.05,26.92 IC24.9 | 80.65,26.92 IC9.9 | 67.95,26.92 IC8.9 | 55.25,26.92 IC7.9 | 42.55,26.92 IC3.9 | 29.85,26.92 IC2.9 | 17.15,26.92 IC1.9 | 40.01,26.92 v40.01,28.19 | 52.71,26.92 v52.71,28.19 | 65.41,26.92 v65.41,28.19 | 78.11,26.92 v78.11,28.19 | 90.81,26.92 v90.81,28.19 | 103.51,26.92 v103.51,28.19 | 116.21,26.92 116.21,27.05 v116.21,28.19 | 18.42,26.92 v18.42,28.19 | 31.12,26.92 v31.12,28.19 | 43.82,26.92 v43.82,28.19 | 56.52,26.92 v56.52,28.19 | 69.22,26.92 v69.22,28.19 | 81.92,26.92 v81.92,28.19 | 94.62,26.92 v94.62,28.19 | 107.32,26.92 v107.32,28.19 | 12.07,26.92 v12.07,28.19 | v74.72,81.28 74.72,81.43
  Bottom 0.813: v74.7,96.62 74.72,81.43 v74.72,81.28 74.76,65.99 v74.76,66.12 v74.8,51.05 v74.8,53.85 | v14.48,58.67 v16.89,58.67 18.92,56.64 v18.92,50.55 | v119.38,73.79 119.38,64.9 119.32,64.83 v119.38,64.77
  Bottom 1.27: 3.81,26.92 4.45,26.92 12.07,26.92 17.15,26.92 18.42,26.92 24.77,26.92 27.31,26.92 29.85,26.92 31.12,26.92 37.47,26.92 40.01,26.92 42.55,26.92 43.82,26.92 50.17,26.92 52.71,26.92 55.25,26.92 56.52,26.92 62.87,26.92 65.41,26.92 67.95,26.92 69.22,26.92 75.57,26.92 78.11,26.92 80.65,26.92 81.92,26.92 88.27,26.92 90.81,26.92 93.35,26.92 94.62,26.92 100.97,26.92 103.51,26.92 106.05,26.92 107.32,26.92 113.67,26.92 116.21,26.92 | IC28.2 120.52,25.4 119.13,26.8 | 119.13,26.8 119,26.92 116.33,26.92 116.21,27.05 | v119.63,29.72 119.13,29.21 119.13,26.8
  pour Top (isolate 0.254): 138.43,24.77 138.43,36.2 124.46,36.2 124.46,24.77
DIR/CHAN  (via drill 0.5)
  Top 0.229: IC23.11 112.4,36.2 v112.65,36.45
  Top 0.305: v112.65,46.99 113.28,46.99 113.92,47.62 IC40.9
  Bottom 0.305: v112.65,36.45 v112.65,46.99
DMDI  (via drill 0.5)
  Top 0.229: v66.68,96.77 67.31,96.14 J2.10 | IC23.13 109.86,31.5 109.6,31.75 v109.6,32.89 | v65.53,70.36 67.95,70.36 68.68,69.62 70.23,69.62 70.59,69.98 74.3,69.98 74.68,70.36 v105.79,70.36
  Top 0.305: v65.41,82.55 65.53,82.55 67.31,80.77 J3.10 | v65.41,67.06 65.91,67.06 67.31,65.66 J4.10 | J9.10 67.31,49.91 v65.79,51.44
  Bottom 0.305: 64.77,67.06 64.77,52.45 v65.79,51.44 | 64.77,67.06 64.77,70.36 | 64.77,82.55 64.77,94.87 v66.68,96.77 | 64.77,82.55 v65.41,82.55 | 64.77,67.06 v65.41,67.06 | v109.6,32.89 109.6,38.61 105.79,42.42 v105.79,70.36 | 64.77,70.36 64.77,82.55 | 64.77,70.36 v65.53,70.36
DMDO  (via drill 0.5)
  Top 0.229: J2.9 68.58,96.01 v67.82,96.77 | 111.13,30.99 110.36,31.75 v110.36,32.13 | v67.44,69.6 68.15,69.6 68.5,69.24 70.43,69.24 70.79,69.6 v106.55,69.6
  Top 0.305: J3.9 68.58,81.03 v67.44,82.17 | J4.9 68.58,65.53 v67.44,66.67 | J9.9 68.58,49.78 v67.44,50.93 | 111.13,30.99 IC23.12
  Bottom 0.305: v67.82,96.77 67.44,96.39 v67.44,82.17 v67.44,69.6 v67.44,66.67 v67.44,50.93 | v110.36,32.13 110.36,38.61 106.55,42.42 v106.55,69.6
F0DATA0
  Top 0.305: IC15.3 19.69,19.3 20.89,19.3 | 20.89,19.3 22.23,19.3 IC15.5 | J1.A7 56.24,3.56 55.31,3.56 54.8,3.05 53.85,3.05 52.96,3.94 52.96,4.45 51.56,5.84 51.56,6.67 51.12,7.11 50.04,7.11 49.47,6.54 20.96,6.54 20.89,6.6 20.89,19.3
F0DATA1
  Top 0.305: IC15.4 20.96,22.86 23.5,22.86 IC15.6 23.5,7.81 46.8,7.81 48.51,9.53 54.36,9.53 55.56,8.32 55.56,7.62 56.52,6.67 57.09,6.67 57.53,7.11 58.61,7.11 59.12,6.6 59.12,4.38 J1.A9
F0DATA2
  Top 0.305: IC16.3 32.39,19.3 33.91,19.3 | 33.91,19.3 34.93,19.3 IC16.5 | J1.A11 61.9,4.84 61.66,5.08 61.66,6.48 60.9,7.24 60.9,8.76 60.14,9.53 56.01,9.53 54.86,10.67 48.01,10.67 46.29,8.95 33.91,8.95 33.91,19.3
F0DATA3
  Top 0.305: IC16.4 33.66,22.86 36.2,22.86 IC16.6 36.2,10.16 45.59,10.16 47.37,11.94 55.37,11.94 56.64,10.67 61.47,10.67 63.44,8.7 63.44,7.3 64.14,6.6 64.14,5.46 64.44,5.16 J1.A13
F0DATA4
  Top 0.305: IC17.3 45.09,19.3 46.67,19.3 | 46.67,19.3 47.63,19.3 IC17.5 | J1.A15 66.98,5.03 66.74,5.27 66.74,6.54 65.98,7.3 65.98,8.89 65.22,9.65 64.2,9.65 62.1,11.75 57.34,11.75 56.01,13.08 46.55,13.08 46.55,19.18 46.67,19.3
F0DATA5
  Top 0.305: IC17.4 46.36,22.86 48.9,22.86 IC17.6 48.9,14.35 56.58,14.35 58.04,12.89 63.75,12.89 67.18,9.46 67.88,9.46 68.52,8.83 68.52,7.37 69.28,6.6 69.28,5.02 69.52,4.78 J1.A17
F1DATA0  (via drill 0.5)
  Top 0.305: J1.A8 57.85,2.48 57.85,4.64 57.34,5.14 56.2,5.14 55.88,4.83 55.25,4.83 54.86,5.21 54.36,5.21 54.04,5.52 54.04,6.54 52.9,7.68 52.9,8.32 52.26,8.95 48.77,8.95 46.99,7.18 21.72,7.18 v21.72,16.89
  Bottom 0.305: IC1.5 20.96,22.86 23.5,22.86 IC1.3 23.5,19.37 22.92,18.8 22.92,18.1 v21.72,16.89
F1DATA1  (via drill 0.5)
  Top 0.305: J1.A6 54.33,1.02 51.56,1.02 51.56,2.92 51.25,3.24 50.29,3.24 50.29,4.7 49.09,5.91 20.07,5.91 v20.07,16.89
  Bottom 0.305: IC1.4 22.23,19.3 20.07,19.3 | 20.07,19.3 19.69,19.3 IC1.6 | v20.07,16.89 20.07,19.3
F1DATA2  (via drill 0.5)
  Top 0.305: J1.A12 63.17,4.39 62.17,5.4 62.17,6.48 62.93,7.24 62.93,8.45 62.36,9.02 61.4,9.02 60.33,10.1 56.33,10.1 55.12,11.3 47.75,11.3 45.97,9.53 35.05,9.53 v35.05,16.83
  Bottom 0.305: IC2.5 33.66,22.86 36.2,22.86 IC2.3 36.13,20.99 36.13,19.18 35.05,18.1 v35.05,16.83
F1DATA3  (via drill 0.5)
  Top 0.305: J1.A10 60.45,2.41 60.45,4.64 59.63,5.46 59.63,6.6 60.39,7.37 60.39,8.51 59.94,8.95 55.75,8.95 54.61,10.1 48.26,10.1 46.55,8.38 32.96,8.38 v32.96,16.83
  Bottom 0.305: IC2.4 34.93,19.3 32.96,19.3 | 32.96,19.3 32.39,19.3 IC2.6 | v32.96,16.83 32.96,19.3
F1DATA4  (via drill 0.5)
  Top 0.305: J1.A16 68.25,3.25 68.01,3.49 68.01,4.83 67.25,5.59 67.25,6.6 68.01,7.37 68.01,8.45 67.5,8.95 66.8,8.95 63.44,12.32 57.72,12.32 56.33,13.72 47.5,13.72 v47.5,16.89
  Bottom 0.305: IC3.5 46.36,22.86 48.9,22.86 IC3.3 48.9,19.11 47.5,17.72 v47.5,16.89
F1DATA5  (via drill 0.5)
  Top 0.305: J1.A14 65.71,4.58 64.71,5.59 64.71,6.6 65.47,7.37 65.47,8.45 64.83,9.08 63.88,9.08 61.72,11.24 56.96,11.24 55.69,12.51 45.66,12.51 v45.66,16.89
  Bottom 0.305: IC3.4 47.63,19.3 45.66,19.3 | 45.66,19.3 45.09,19.3 IC3.6 | v45.66,16.89 45.66,19.3
F2DATA0
  Top 0.305: IC4.3 57.79,19.3 59.31,19.3 | 59.31,19.3 60.33,19.3 IC4.5 | J1.A19 72.06,4.71 71.82,4.95 71.82,6.67 71.06,7.43 71.06,8.76 65.79,14.03 59.69,14.03 59.18,14.54 59.18,19.18 59.31,19.3
F2DATA1
  Top 0.305: IC4.4 59.06,22.86 61.6,22.86 IC4.6 61.6,15.11 67.25,15.11 73.6,8.76 73.6,7.37 74.36,6.6 74.36,4.83 74.6,4.58 J1.A21
F2DATA2
  Top 0.305: IC5.3 70.49,19.3 72.07,19.3 | 72.07,19.3 73.03,19.3 IC5.5 | J1.A23 77.14,4.84 76.9,5.08 76.9,6.54 76.14,7.3 76.14,9.08 72.01,13.21 72.01,19.24 72.07,19.3
F2DATA3
  Top 0.305: IC5.4 71.76,22.86 74.3,22.86 IC5.6 74.3,14.35 78.68,9.97 78.68,7.37 79.68,6.36 J1.A25
F2DATA4
  Top 0.305: IC6.5 85.73,19.3 84.84,19.3 | 84.84,19.3 83.19,19.3 IC6.3 | J1.A27 82.49,4.41 82.49,6.6 83.25,7.37 83.25,9.02 84.84,10.6 84.84,19.3
F2DATA5
  Top 0.305: IC6.4 84.46,22.86 87,22.86 IC6.6 87,10.29 85.79,9.08 85.79,7.56 85.03,6.79 85.03,5.4 84.77,5.14 J1.A29
F3DATA0  (via drill 0.5)
  Top 0.305: J1.A20 73.33,3 73.09,3.24 73.09,4.64 72.33,5.4 72.33,6.67 73.09,7.43 73.09,8.51 72.45,9.14 71.5,9.14 66.04,14.61 60.07,14.61 v60.07,17.46
  Bottom 0.305: IC7.5 59.06,22.86 61.6,22.86 IC7.3 61.66,20.99 61.66,20.38 61.6,20.32 61.6,19.11 60.07,17.59 v60.07,17.46
F3DATA1  (via drill 0.5)
  Top 0.305: J1.A18 70.79,3.06 70.55,3.3 70.55,4.7 69.79,5.46 69.79,6.67 70.55,7.43 70.55,8.45 65.53,13.46 59.31,13.46 58.36,14.41 v58.36,17.46
  Bottom 0.305: IC7.4 60.33,19.3 58.23,19.3 | 58.23,19.3 57.79,19.3 IC7.6 | v58.36,17.46 58.36,19.18 58.23,19.3
F3DATA2  (via drill 0.5)
  Top 0.305: J1.A24 78.41,3.06 78.17,3.3 78.17,4.76 77.41,5.52 77.41,6.67 78.17,7.43 78.17,8.57 73.22,13.53 v73.22,17.4
  Bottom 0.305: IC8.5 71.76,22.86 74.3,22.86 IC8.3 74.3,19.56 73.22,18.48 v73.22,17.4
F3DATA3  (via drill 0.5)
  Top 0.305: J1.A22 75.87,2.87 75.63,3.11 75.63,4.57 74.87,5.33 74.87,6.6 75.63,7.37 75.63,8.51 71.12,13.02 v71.12,17.34
  Bottom 0.305: IC8.4 73.03,19.3 71.06,19.3 | 71.06,19.3 70.49,19.3 IC8.6 | v71.12,17.34 71.12,19.24 71.06,19.3
F3DATA4  (via drill 0.5)
  Top 0.305: J1.A28 83.5,2.25 83.5,4.64 84.52,5.65 84.52,6.67 83.76,7.43 83.76,8.64 86.23,11.11 v86.23,16.95
  Bottom 0.305: IC9.5 84.46,22.86 87,22.86 IC9.3 87,18.99 86.87,18.86 86.87,17.59 v86.23,16.95
F3DATA5  (via drill 0.5)
  Top 0.305: J1.A26 80.96,2.25 80.96,4.45 81.98,5.46 81.98,6.67 81.22,7.43 81.22,8.57 84.07,11.43 v84.07,16.95
  Bottom 0.305: IC9.6 83.19,19.3 84.07,19.3 | 84.07,19.3 85.73,19.3 IC9.4 | v84.07,16.95 84.07,19.3
FACON0
  Top 0.305: J1.A44 103.82,2.25 103.82,4.51 104.84,5.52 104.84,6.79 104.08,7.56 104.08,8.51 105.73,10.16 112.4,10.16 IC23.6
FACON1  (via drill 0.5)
  Top 0.305: J1.A37 95.19,4.41 95.19,6.6 95.95,7.37 95.95,8.95 99.25,12.26 v99.7,12.26
  Bottom 0.305: v99.7,12.26 IC25.3
FACON2  (via drill 0.5)
  Top 0.305: J1.A35 92.38,4.75 92.65,5.02 92.65,6.73 93.41,7.49 93.41,9.02 v97.98,13.59
  Bottom 0.305: v97.98,13.59 98.43,14.03 IC25.4
FACON3  (via drill 0.5)
  Top 0.305: J1.A33 89.84,4.94 90.11,5.21 90.11,6.67 90.87,7.43 90.87,9.59 v94.74,13.46
  Bottom 0.305: v94.74,13.46 95.57,13.46 97.16,15.05 IC25.5
FASP0
  Top 0.305: J1.A30 86.03,4.43 87.06,5.46 87.06,6.73 86.3,7.49 86.3,8.45 93.73,15.88 95.89,15.88 96.33,16.32 96.33,18.86 95.89,19.3 IC22.3
FASP1
  Top 0.305: J1.A32 88.57,4.5 89.6,5.52 89.6,6.67 88.84,7.43 88.84,8.83 94.23,14.22 96.33,14.22 97.16,15.05 IC22.4
FASP2
  Top 0.305: J1.A34 91.11,4.43 92.14,5.46 92.14,6.67 91.38,7.43 91.38,8.38 98.43,15.43 IC22.5
FASP3
  Top 0.305: J1.A36 93.66,2.25 93.66,4.45 94.68,5.46 94.68,6.6 93.92,7.37 93.92,8.7 97.85,12.64 98.55,12.64 99.7,13.78 IC22.6
FDSP0
  Top 0.305: J1.A38 96.2,2.25 96.2,4.51 97.22,5.52 97.22,6.6 96.46,7.37 96.46,8.51 98.62,10.67 99.31,10.67 104.52,15.88 108.78,15.88 108.84,15.94 108.84,19.05 108.59,19.3 IC23.3
FDSP1
  Top 0.305: J1.A40 98.74,2.25 98.74,4.51 99.76,5.52 99.76,6.67 99,7.43 99,8.7 104.33,14.03 109.86,14.03 IC23.4
FDSP2
  Top 0.305: J1.A42 101.28,2.25 101.28,4.51 102.3,5.52 102.3,6.73 101.54,7.49 101.54,8.7 105.03,12.19 111.13,12.19 IC23.5
FPGA_3.3V  (via drill 0.5)
  Top 0.305: IC12.14 11.48,6.39 10.54,5.46 7.87,5.46 5.21,8.13 C49.1
  Top 0.61: 5.72,24.38 IC13.10 5.72,17.66 C9.1 | 17.15,24.38 IC15.1 17.15,18.93 C10.1 | 29.85,24.38 IC16.1 29.85,18.93 C12.1 | 42.55,24.38 IC17.1 42.55,18.93 C14.1 | 55.25,24.38 IC4.1 55.25,18.93 C16.1 | 67.95,24.38 IC5.1 67.95,18.93 C18.1 | 80.65,24.38 IC6.1 80.65,18.93 C20.1 | 93.35,24.38 IC22.1 v93.35,19.3 93.35,18.67 C22.1 | 106.05,24.38 IC23.1 v106.05,19.24 106.05,18.67 C24.1 | 13.34,24.38 IC13.16 | 27.31,24.38 v27.31,23.11 | 40.01,24.38 v40.01,23.11 | 52.71,24.38 v52.71,23.11 | 65.41,24.38 v65.41,23.11 | 78.11,24.38 v78.11,23.11 | 90.81,24.38 v90.81,23.11 | 103.51,24.38 v103.51,23.11 | 116.21,24.38 v116.21,23.11 | 113.67,24.38 IC23.7 | 100.97,24.38 IC22.7
  Top 1.27: 116.21,24.38 113.67,24.38 106.05,24.38 103.51,24.38 100.97,24.38 93.35,24.38 90.81,24.38 80.65,24.38 78.11,24.38 67.95,24.38 65.41,24.38 55.25,24.38 52.71,24.38 42.55,24.38 40.01,24.38 29.85,24.38 27.31,24.38 17.15,24.38 13.34,24.38 5.72,24.38 3.81,24.38 1.14,21.72 1.14,10.41 | 48.9,2.23 47.57,2.23 46.61,1.27 3.18,1.27 1.14,3.3 1.14,10.41 | 48.9,2.23 J1.A2 | C49.1 1.4,10.28 1.14,10.41 | J1.A1 49.2,2.54 48.9,2.23
  Bottom 0.61: IC1.1 26.52,21.05 27.31,21.84 | v27.31,23.11 27.31,21.84 | IC2.1 39.22,21.05 39.69,21.53 | 39.69,21.53 40.01,21.84 v40.01,23.11 | IC3.1 51.92,21.05 52.39,21.53 | 52.39,21.53 52.71,21.84 v52.71,23.11 | IC7.1 64.62,21.05 65.09,21.53 | 65.09,21.53 65.41,21.84 v65.41,23.11 | IC8.1 77.32,21.05 77.79,21.53 | 77.79,21.53 78.11,21.84 v78.11,23.11 | IC9.1 90.02,21.05 90.49,21.53 | 90.49,21.53 90.81,21.84 v90.81,23.11 | IC25.1 102.72,21.05 103.19,21.53 | 103.19,21.53 103.51,21.84 v103.51,23.11 | IC24.1 115.42,21.05 115.89,21.53 | 115.89,21.53 116.21,21.84 v116.21,23.11 | C11.1 27.44,21.71 27.31,21.84 | C13.1 40.14,21.08 39.69,21.53 | C15.1 52.84,21.08 52.39,21.53 | C17.1 65.54,21.08 65.09,21.53 | C19.1 78.24,21.08 77.79,21.53 | C21.1 90.94,21.08 90.49,21.53 | C23.1 103.64,21.08 103.19,21.53 | C25.1 116.21,17.53 116.21,21.21 115.89,21.53 | IC24.7 107.32,19.18 106.11,19.18 v106.05,19.24 | IC25.7 94.62,19.18 93.47,19.18 v93.35,19.3
FPGA_GND  (via drill 0.5)
  Top 0.305: C49.2 IC12.7 7.58,9.19 8.26,8.51 8.26,7.27 IC12.9 8.26,7.21 8.26,6.6 8.64,6.22 9.27,6.22 9.53,6.48 IC12.11
  Top 0.61: IC15.2 18.42,19.94 | C9.2 3.3,19.91 IC13.9 v4.45,23.11 | IC15.2 18.42,17.66 C10.2 | C12.2 31.12,17.66 IC16.2 v31.12,23.11 | C14.2 43.82,17.66 IC17.2 v43.82,23.11 | C16.2 56.52,17.66 IC4.2 v56.52,23.11 | C18.2 69.22,17.66 IC5.2 v69.22,23.11 | C20.2 81.92,17.66 IC6.2 v81.92,23.11 | C22.2 94.62,17.66 IC22.2 v94.62,23.11 | C24.2 107.32,17.66 IC23.2 v107.32,23.11 | v12.07,23.11 IC13.15 | v38.74,23.11 IC16.8 | v18.42,23.11 IC15.2 | v26.04,23.11 IC15.8 | v51.44,23.11 IC17.8 | v64.14,23.11 IC4.8 | v76.84,23.11 IC5.8 | v89.54,23.11 IC6.8 | v102.24,23.11 IC22.8 | v114.94,23.11 IC23.8
  Top 0.813: C49.2 3.18,13.08 3.18,17.02 C9.2
  Bottom 0.305: J1.B50 111.43,3.86 109.86,2.29 108.94,2.29 J1.A48 J1.A46
  Bottom 0.61: 113.67,24.38 IC24.2 113.67,17.66 C25.2 | 100.97,24.38 IC25.2 100.97,17.66 C23.2 | C11.2 24.77,17.66 IC1.2 24.77,24.38 | 88.27,24.38 IC9.2 88.27,17.66 C21.2 | 75.57,24.38 IC8.2 75.57,17.66 C19.2 | 62.87,24.38 IC7.2 62.87,17.66 C17.2 | 50.17,24.38 IC3.2 50.17,17.66 C15.2 | 37.47,24.38 IC2.2 37.47,17.66 C13.2 | v4.45,23.11 4.45,24.38 | 12.07,24.38 v12.07,23.11 | 17.15,24.38 IC1.8 | 29.85,24.38 IC2.8 | 38.74,24.38 v38.74,23.11 | 18.42,24.38 v18.42,23.11 | 26.04,24.38 v26.04,23.11 | 31.12,24.38 v31.12,23.11 | 43.82,24.38 v43.82,23.11 | 51.44,24.38 v51.44,23.11 | 56.52,24.38 v56.52,23.11 | 64.14,24.38 v64.14,23.11 | 69.22,24.38 v69.22,23.11 | 76.84,24.38 v76.84,23.11 | 81.92,24.38 v81.92,23.11 | 89.54,24.38 v89.54,23.11 | 94.62,24.38 v94.62,23.11 | 102.24,24.38 v102.24,23.11 | 107.32,24.38 v107.32,23.11 | 114.94,24.38 v114.94,23.11 | 42.55,24.38 IC3.8 | 55.25,24.38 IC7.8 | 67.95,24.38 IC8.8 | 80.65,24.38 IC9.8 | 93.35,24.38 IC25.8 | 106.05,24.38 IC24.8
  Bottom 1.27: 3.81,24.38 4.45,24.38 12.07,24.38 17.15,24.38 18.42,24.38 24.77,24.38 26.04,24.38 29.85,24.38 31.12,24.38 37.47,24.38 38.74,24.38 42.55,24.38 43.82,24.38 50.17,24.38 51.44,24.38 55.25,24.38 56.52,24.38 62.87,24.38 64.14,24.38 67.95,24.38 69.22,24.38 75.57,24.38 76.84,24.38 80.65,24.38 81.92,24.38 88.27,24.38 89.54,24.38 93.35,24.38 94.62,24.38 100.97,24.38 102.24,24.38 106.05,24.38 107.32,24.38 113.67,24.38 114.94,24.38 118.11,24.38 118.75,23.75 118.75,8.89 116.66,6.81 115.49,6.81 112.27,6.86 J1.B50
  pour Bottom: 46.36,5.71 112.9,5.59 113.28,5.97 116.84,5.97 116.84,9.53 46.36,9.53
FSHARED0  (via drill 0.5)
  Top 0.305: J1.A31 87.3,4.94 87.57,5.21 87.57,6.67 88.33,7.43 88.33,9.53 93.85,15.05 v95.89,15.05
  Bottom 0.305: v95.89,15.05 IC25.6
FSHARED1  (via drill 0.5)
  Top 0.305: J1.A45 105.08,4.94 105.35,5.21 105.35,6.67 106.17,7.49 106.17,8.51 107.19,9.53 113.16,9.53 113.16,12.89 v113.6,13.34
  Bottom 0.305: v113.6,13.34 112.01,14.92 112.01,18.86 112.4,19.24 IC24.3
FSHARED2  (via drill 0.5)
  Top 0.305: J1.A43 102.81,4.41 102.81,6.73 103.57,7.49 103.57,8.7 106.11,11.24 v111.13,11.24
  Bottom 0.305: v111.13,11.24 IC24.4
FSHARED3  (via drill 0.5)
  Top 0.305: J1.A41 100.27,4.41 100.27,6.67 101.03,7.43 101.03,9.14 104.97,13.08 v109.86,13.08
  Bottom 0.305: v109.86,13.08 IC24.5
FSHARED4  (via drill 0.5)
  Top 0.305: J1.A39 97.73,4.41 97.73,6.6 98.49,7.37 98.49,8.95 104.46,14.92 v108.59,14.92
  Bottom 0.305: v108.59,14.92 IC24.6
ISLOTDIR0
  Top 0.305: IC13.11 6.99,19.56 8.26,18.29 8.26,15.37 8.88,14.75 IC12.5
ISLOTDIR1
  Top 0.305: IC13.12 8.26,19.56 10.8,17.02 10.8,15.11 10.18,14.49 IC12.3
ISLOTDIR2
  Top 0.305: IC13.13 9.53,19.68 13.34,15.88 11.43,13.97 11.43,13.12 IC12.1
ISLOTDIR3
  Top 0.305: IC13.14 10.8,19.43 14.22,16 14.22,12.06 10.8,8.64 10.8,7.27 IC12.13
MCLK  (via drill 0.5)
  Top 0.229: J2.20 66.04,89.66 64.64,88.27 v63.5,88.27 | v65.41,96.77 66.04,96.14 J2.11 | v65.02,39.12 66.17,37.97 67.95,37.97 68.33,38.35 93.47,38.35 94.87,36.96 | IC40.2 110.01,42.06 109.86,41.91 103.38,41.91 v103,42.29
  Top 0.305: J9.20 66.04,44.32 v65.28,43.56 | J9.11 66.04,50.04 64.64,51.44 v64.14,51.44 | J4.20 66.04,59.56 64.26,57.78 v63.5,57.78 | J4.11 66.04,65.53 65.28,66.29 64.26,66.29 v63.5,67.06 | J3.20 66.04,74.42 64.64,73.03 v63.5,73.03 | J3.11 66.04,81.03 65.41,81.66 64.39,81.66 v63.5,82.55 | 94.87,36.96 97.16,34.67 IC22.13 v97.16,28.32 | IC40.2 110.01,44.17 v109.98,44.2 | v117.6,60.45 117.6,58.8 117.48,58.67 114.55,58.67 114.55,60.45 v109.98,60.45 109.98,59.08 IC39.2 | v117.6,91.31 117.6,91.82 117.48,91.95 117.48,92.75 IC37.8 | IC31.8 117.52,76.28 v117.6,76.2 | IC38.8 27.1,48.09 27.31,47.88 v29.97,47.88
  Bottom 0.229: v65.28,43.56 65.28,39.37 v65.02,39.12
  Bottom 0.305: 64.14,52.07 64.14,57.78 | 64.14,57.78 64.14,67.06 | 64.14,67.06 64.14,73.03 | 64.14,73.03 64.14,82.55 | 64.14,82.55 64.14,88.27 | 64.14,88.27 64.01,96.65 64.14,96.77 v65.41,96.77 | 64.14,88.27 v63.5,88.27 | 64.14,82.55 v63.5,82.55 | 64.14,73.03 v63.5,73.03 | 64.14,67.06 v63.5,67.06 | 64.14,57.78 v63.5,57.78 | v65.28,43.56 64.14,44.7 v64.14,51.44 64.14,52.07 | v103,42.29 103,39.62 99.44,36.07 99.44,33.78 100.33,32.89 100.33,28.32 v97.16,28.32 | v109.98,44.2 v109.98,60.45 | v117.6,60.45 v117.6,76.2 v117.6,91.31 | v29.97,47.88 53.47,47.88 57.66,52.07 64.14,52.07
N$1
  pour Bottom (isolate 0.254): 126.37,96.52 134.62,96.52 136.53,94.61 136.53,83.19 126.37,83.19
N$2
  pour Bottom (isolate 0.254): 136.53,81.92 130.81,81.92 130.81,74.3 123.19,74.3 123.19,53.34 131.45,53.34 131.45,64.14 136.53,64.14
N$3
  Top 0.305: IC11.2 112.03,87.64 112.4,88.01 114.43,88.01 114.81,87.63 114.81,87.01 IC37.3
N$4
  Top 0.305: IC37.4 115.44,87.76 114.68,88.52 112.01,88.52 111.76,88.27 110.39,88.27 IC11.3
N$5
  Top 0.305: IC37.5 116.09,87.87 114.94,89.03 111.25,89.03 111.13,88.9 110.4,88.9 IC11.4
N$6
  Top 0.305: IC37.6 116.74,87.98 115.19,89.53 110.42,89.53 IC11.5
N$7
  Top 0.305: IC37.10 116.09,91.45 114.81,90.17 110.43,90.17 IC11.6
N$8
  Top 0.305: IC37.11 115.44,91.69 114.55,90.81 112.01,90.81 111.89,90.93 110.4,90.93 IC11.7
N$9
  Top 0.305: IC37.12 114.79,91.93 114.17,91.31 112.78,91.31 112.52,91.57 110.64,91.57 IC11.8
N$10
  Top 0.305: IC37.13 114.14,92.17 113.79,91.82 113.03,91.82 112.65,92.2 110.37,92.2 IC11.9
N$11
  Top 0.305: IC31.3 114.92,72.53 114.55,72.9 113.16,72.9 112.65,72.39 IC18.2
N$12
  Top 0.305: IC31.4 115.57,72.77 114.94,73.41 112.78,73.41 112.4,73.03 110.39,73.03 IC18.3
N$13
  Top 0.305: IC31.5 116.22,73.01 115.19,74.04 112.52,74.04 112.14,73.66 110.4,73.66 IC18.4
N$14
  Top 0.305: IC31.6 116.87,73.25 115.57,74.55 111.51,74.55 111.25,74.3 110.42,74.3 IC18.5
N$15
  Top 0.305: IC31.10 116.22,76.34 114.94,75.06 110.42,75.06 IC18.6
N$16
  Top 0.305: IC31.11 115.57,76.58 114.68,75.69 110.4,75.69 IC18.7
N$17
  Top 0.305: IC31.12 114.92,76.82 114.3,76.2 112.65,76.2 112.52,76.33 110.39,76.33 IC18.8
N$18
  Top 0.305: IC31.13 114.27,76.93 114.05,76.71 113.16,76.71 112.9,76.96 110.37,76.96 IC18.9
N$19
  Top 1.27: R1.2 IC19.8 11.43,87.76 6.48,82.8 C7.1
N$20
  Top 1.27: R2.2 IC20.8 11.43,56.13 6.48,51.18 C8.1
N$21
  Top 0.305: IC10.3 IC10.2 | IC10.3 13.34,75.8 | IC10.5 12.05,76.44 12.32,76.71 13.08,76.71 13.34,76.45 13.34,75.83 IC10.3
N$22
  Top 0.305: IC10.8 10.75,70.82 10.92,70.99 12.7,70.99 | 12.7,70.99 13.84,70.99 13.97,70.87 13.97,70.01 IC10.13 | 12.7,70.99 IC10.11
N$23
  Top 0.305: IC38.3 21.1,50.69 21.46,51.05 21.46,52.7 21.34,52.83 21.34,55.36 IC33.2
N$24
  Top 0.305: IC38.4 21.21,50.04 21.97,50.8 21.97,55.35 IC33.3
N$25
  Top 0.305: IC38.5 21.45,49.39 22.61,50.55 22.61,55.21 IC33.4
N$26
  Top 0.305: IC38.6 21.69,48.74 23.11,50.16 23.11,54.1 23.24,54.23 23.24,55.32 IC33.5
N$27
  Top 0.305: IC38.10 24.78,49.39 23.62,50.67 23.62,53.34 24,53.72 24,55.32 IC33.6
N$28
  Top 0.305: IC38.11 25.02,50.04 24.13,50.93 24.13,53.09 24.64,53.59 24.64,55.33 IC33.7
N$29